# Altium schematic sheet Mid485.SchDoc
size A4
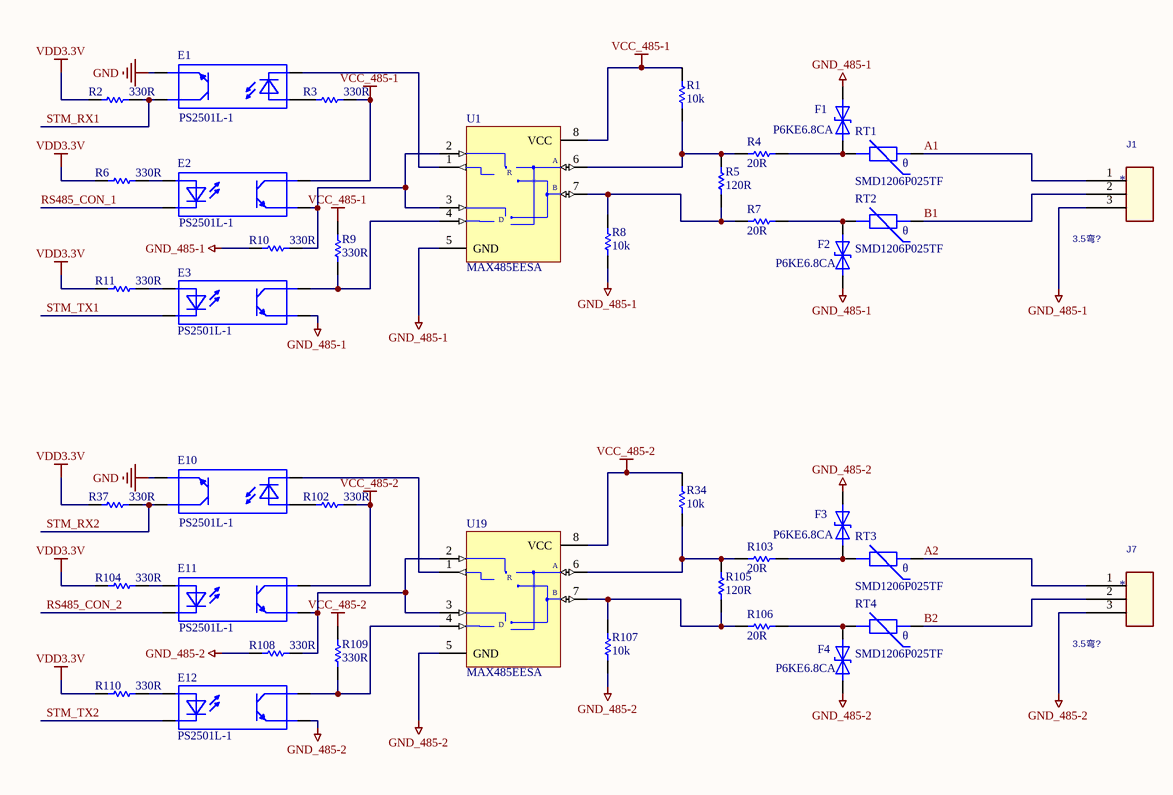
[diagram p0: Mid485.SchDoc]

## Parts
E1  PS2501L-1  [NEC2501]
E2  PS2501L-1  [NEC2501]
E3  PS2501L-1  [NEC2501]
E10  PS2501L-1  [NEC2501]
E11  PS2501L-1  [NEC2501]
E12  PS2501L-1  [NEC2501]
F1  P6KE6.8CA  [P6KE6,8CA]
F2  P6KE6.8CA  [P6KE6,8CA]
F3  P6KE6.8CA  [P6KE6,8CA]
F4  P6KE6.8CA  [P6KE6,8CA]
J1  *  [3.5-P3]
J7  *  [3.5-P3]
R1  value 10k  [0805]  (hidden comment: Res Semi)
R2  value 330R  [0805]  (hidden comment: Res Semi)
R3  value 330R  [0805]  (hidden comment: Res Semi)
R4  value 20R  [0805]  (hidden comment: Res Semi)
R5  value 120R  [0805]  (hidden comment: Res Semi)
R6  value 330R  [0805]  (hidden comment: Res Semi)
R7  value 20R  [0805]  (hidden comment: Res Semi)
R8  value 10k  [0805]  (hidden comment: Res Semi)
R9  value 330R  [0805]  (hidden comment: Res Semi)
R10  value 330R  [0805]  (hidden comment: Res Semi)
R11  value 330R  [0805]  (hidden comment: Res Semi)
R34  value 10k  [0805]  (hidden comment: Res Semi)
R37  value 330R  [0805]  (hidden comment: Res Semi)
R102  value 330R  [0805]  (hidden comment: Res Semi)
R103  value 20R  [0805]  (hidden comment: Res Semi)
R104  value 330R  [0805]  (hidden comment: Res Semi)
R105  value 120R  [0805]  (hidden comment: Res Semi)
R106  value 20R  [0805]  (hidden comment: Res Semi)
R107  value 10k  [0805]  (hidden comment: Res Semi)
R108  value 330R  [0805]  (hidden comment: Res Semi)
R109  value 330R  [0805]  (hidden comment: Res Semi)
R110  value 330R  [0805]  (hidden comment: Res Semi)
RT1  SMD1206P025TF  [1206]
RT2  SMD1206P025TF  [1206]
RT3  SMD1206P025TF  [1206]
RT4  SMD1206P025TF  [1206]
U1  MAX485EESA  [NSO8]
U19  MAX485EESA  [NSO8]

## Nets
GND: E1.3 E10.3
GND_485-1: E3.3 F1.1 F2.2 J1.3 R8.2 R10.2 U1.5(GND)
GND_485-2: E12.3 F3.1 F4.2 J7.3 R107.2 R108.2 U19.5(GND)
VCC_485-1: E2.4 R1.1 R3.1 R9.1 U1.8(VCC)
VCC_485-2: E11.4 R34.1 R102.1 R109.1 U19.8(VCC)
VDD3.3V: R2.2 R6.2 R11.2 R37.2 R104.2 R110.2
A1: J1.1 RT1.2
A2: J7.1 RT3.2
B1: J1.2 RT2.2
B2: J7.2 RT4.2
RS485_CON_1: E2.2
RS485_CON_2: E11.2
STM_RX1: E1.4 R2.1
STM_RX2: E10.4 R37.1
STM_TX1: E3.2
STM_TX2: E12.2
NetE1_1: E1.1 R3.2
NetE1_2: E1.2 U1.1(RO)
NetE2_1: E2.1 R6.1
NetE2_3: E2.3 R10.1 U1.2(~{RE}) U1.3(DE)
NetE3_1: E3.1 R11.1
NetE3_4: E3.4 R9.2 U1.4(DI)
NetE10_1: E10.1 R102.2
NetE10_2: E10.2 U19.1(RO)
NetE11_1: E11.1 R104.1
NetE11_3: E11.3 R108.1 U19.2(~{RE}) U19.3(DE)
NetE12_1: E12.1 R110.1
NetE12_4: E12.4 R109.2 U19.4(DI)
NetF1_2: F1.2 R4.2 RT1.1
NetF2_1: F2.1 R7.2 RT2.1
NetF3_2: F3.2 R103.2 RT3.1
NetF4_1: F4.1 R106.2 RT4.1
NetR1_2: R1.2 R4.1 R5.1 U1.6(A)
NetR5_2: R5.2 R7.1 R8.1 U1.7(B)
NetR34_2: R34.2 R103.1 R105.1 U19.6(A)
NetR105_2: R105.2 R106.1 R107.1 U19.7(B)

## Notes on the sheet
- (in symbol CON3) 3.5弯?
- (in symbol MAX485ESA) R; D
- (in symbol PTC) θ

## Library data of the parts
E1-E3 E10-E12 = OPT: 光耦
F1-F4 = TVS: 快速瞬变二极管
J1 J7 = CON3: TOLERANCE: =J65_TOLERANCE
R1-R11 R34 R37 R102-R110 = Res Semi: Semiconductor Resistor; Published: 8-Jun-2000; LatestRevisionDate: 17-Jul-2002; LatestRevisionNote: Re-released for DXP Platform.; PackageReference: AXIAL-0.5; Publisher: Altium Limited
RT1-RT4 = PTC: 热敏电阻
U1 U19 = MAX485ESA: Low-Power, Slew-Rate-Limited RS-485/RS-422 Transceiver; Code - JEDEC: MS-012-AA; Code - IPC: SO8; Published: 16-Jan-2001; Revision: 17-Jul-2002: Re-released for DXP Platform.; Datasheet: Latest Revision: Feb-1996; Package Reference: NSO8; Publisher: Altium Limited